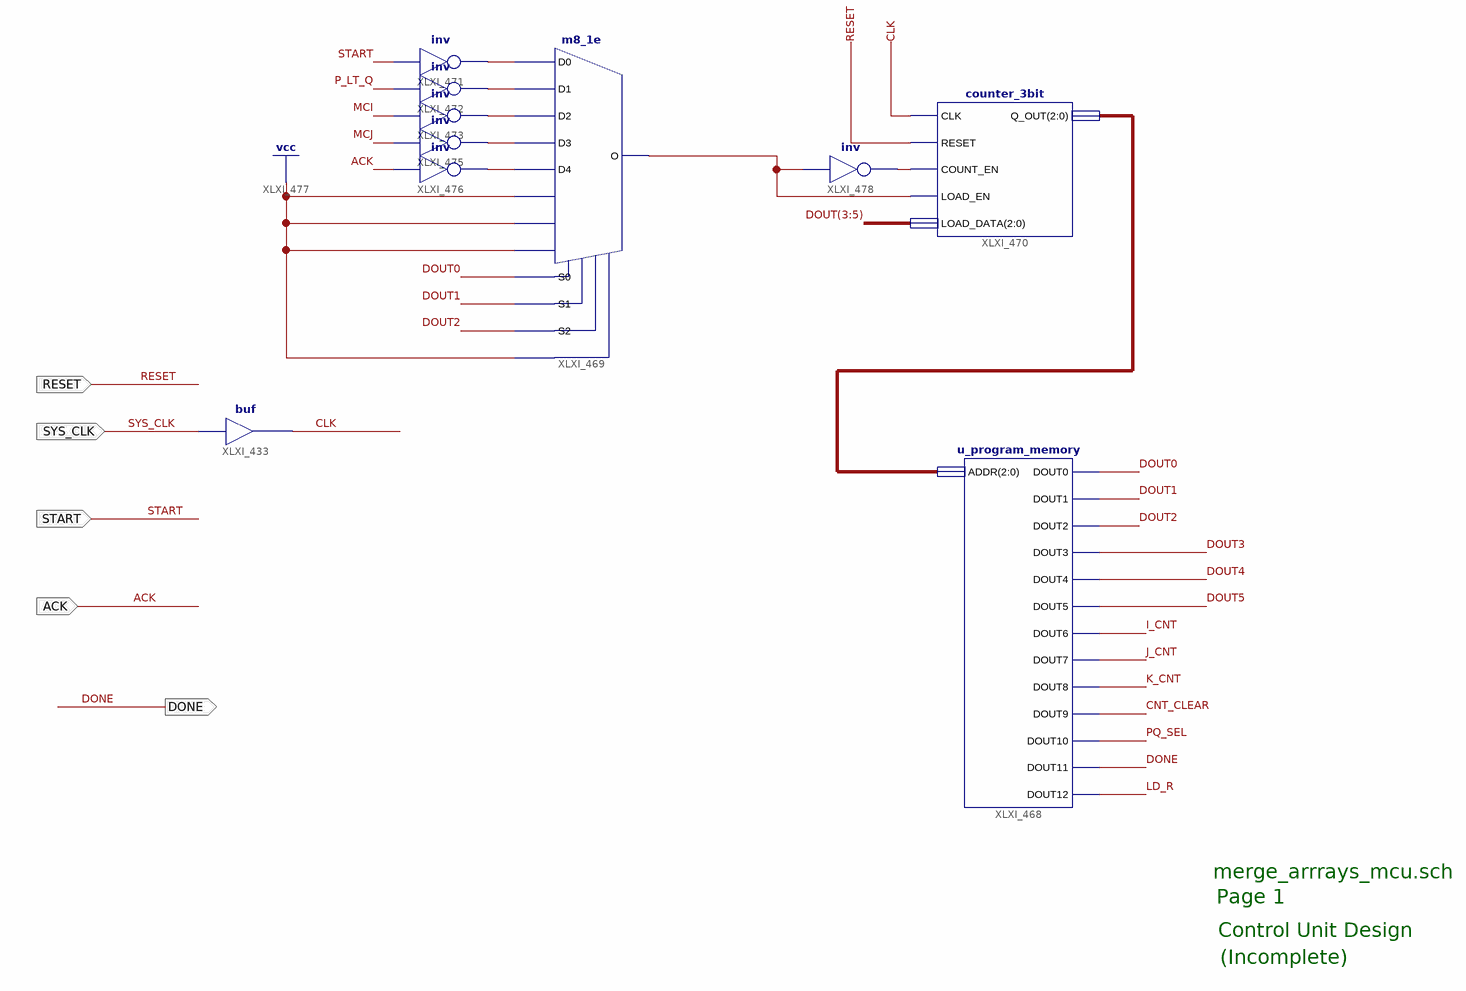
[diagram p0: schematic sheet 1]
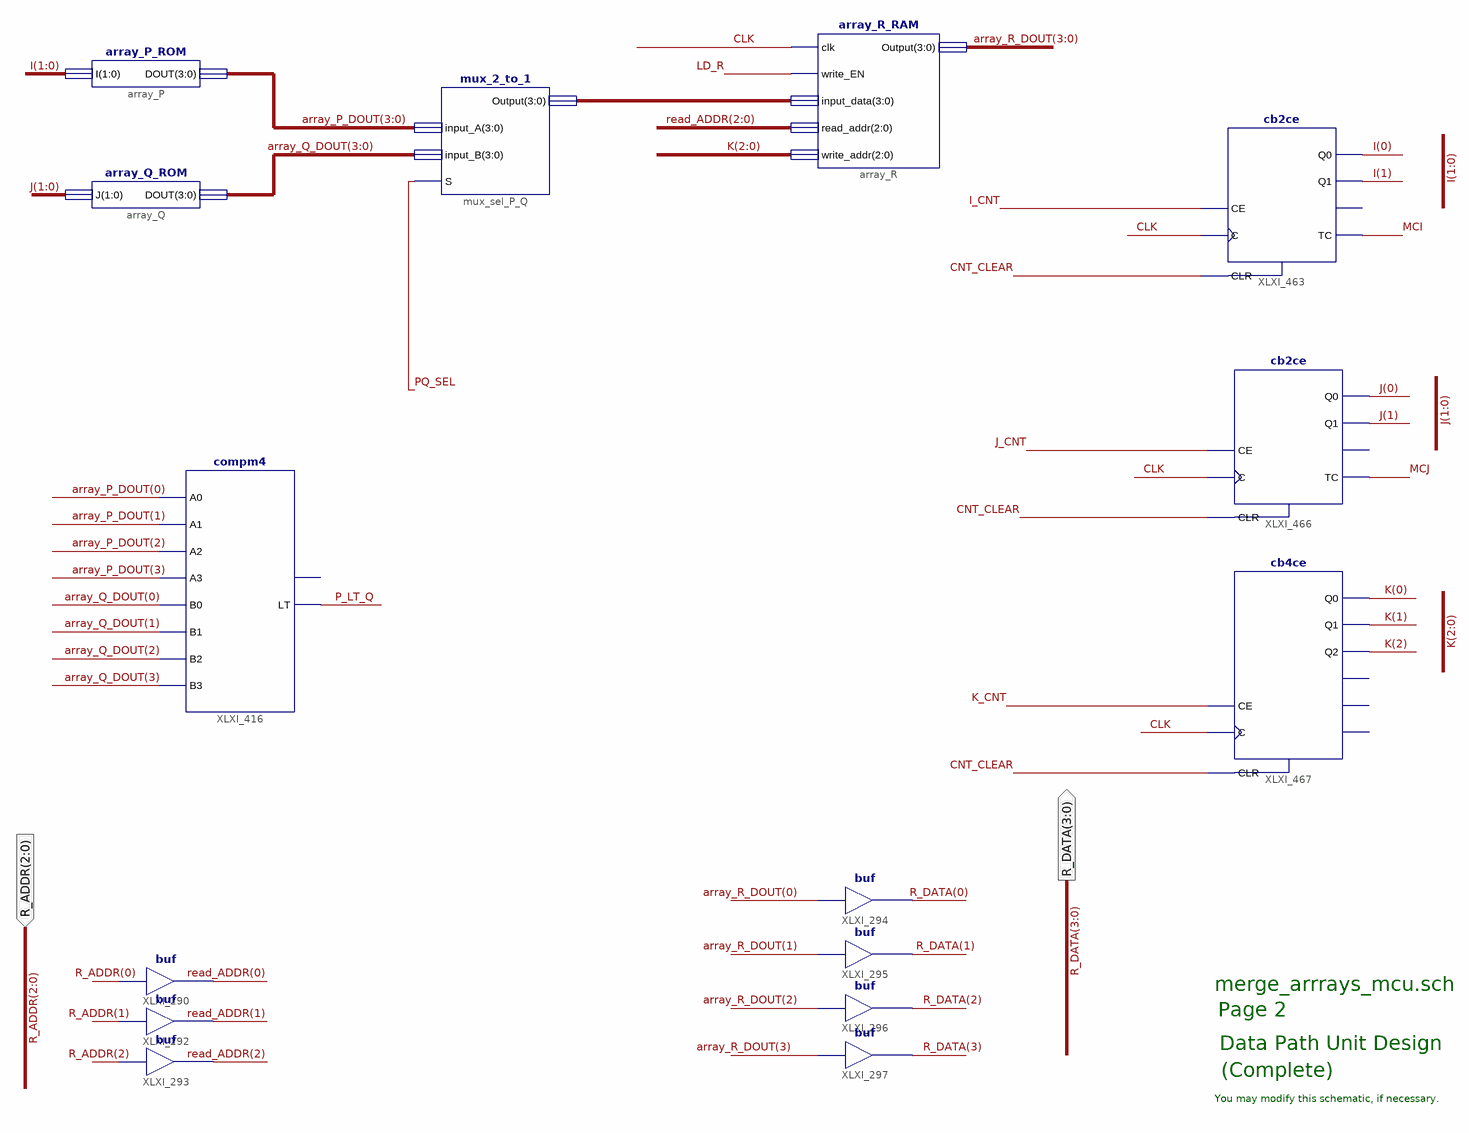
[diagram p1: schematic sheet 2]
// Xilinx ISE schematic merge_arrays_mcu.sch (spartan6) as structural Verilog: 25 symbols, 7 ports
module merge_arrays_mcu (
  input  ACK,
  input  RESET,
  input  SYS_CLK,
  input  START,
  input  [2:0] R_ADDR,
  output [3:0] R_DATA,
  output DONE
);

  wire CLK, CNT_CLEAR, DOUT0, DOUT1, DOUT2, DOUT3, DOUT4, DOUT5, I_CNT, J_CNT, K_CNT, LD_R, MCI, MCJ, P_LT_Q,
       PQ_SEL, XLXN_805, XLXN_806, XLXN_807, XLXN_808, XLXN_809, XLXN_832, XLXN_833;
  wire [1:0] I, J;
  wire [2:0] K, read_ADDR, XLXN_836;
  wire [3:0] array_P_DOUT, array_Q_DOUT, array_R_DOUT, XLXN_149;
  wire [5:3] DOUT;

  array_P_ROM array_P (.I(I), .DOUT(array_P_DOUT));
  array_Q_ROM array_Q (.J(J), .DOUT(array_Q_DOUT));
  mux_2_to_1 mux_sel_P_Q (.input_A(array_P_DOUT), .input_B(array_Q_DOUT), .Output(XLXN_149), .S(PQ_SEL));
  array_R_RAM array_R (
    .clk(CLK), .write_EN(LD_R), .input_data(XLXN_149), .read_addr(read_ADDR), .write_addr(K),
    .Output(array_R_DOUT));
  buf XLXI_294 (R_DATA[0], array_R_DOUT[0]);
  buf XLXI_295 (R_DATA[1], array_R_DOUT[1]);
  buf XLXI_296 (R_DATA[2], array_R_DOUT[2]);
  buf XLXI_297 (R_DATA[3], array_R_DOUT[3]);
  compm4 XLXI_416 (
    .A0(array_P_DOUT[0]), .A1(array_P_DOUT[1]), .A2(array_P_DOUT[2]), .A3(array_P_DOUT[3]),
    .B0(array_Q_DOUT[0]), .B1(array_Q_DOUT[1]), .B2(array_Q_DOUT[2]), .B3(array_Q_DOUT[3]), .LT(P_LT_Q));  // open: GT
  buf XLXI_290 (read_ADDR[0], R_ADDR[0]);
  buf XLXI_292 (read_ADDR[1], R_ADDR[1]);
  buf XLXI_293 (read_ADDR[2], R_ADDR[2]);
  buf XLXI_433 (CLK, SYS_CLK);
  cb2ce XLXI_463 (.C(CLK), .CE(I_CNT), .CLR(CNT_CLEAR), .Q0(I[0]), .Q1(I[1]), .TC(MCI));  // open: CEO
  cb2ce XLXI_466 (.C(CLK), .CE(J_CNT), .CLR(CNT_CLEAR), .Q0(J[0]), .Q1(J[1]), .TC(MCJ));  // open: CEO
  cb4ce XLXI_467 (.C(CLK), .CE(K_CNT), .CLR(CNT_CLEAR), .Q0(K[0]), .Q1(K[1]), .Q2(K[2]));  // open: CEO, Q3, TC
  u_program_memory XLXI_468 (
    .ADDR(XLXN_836), .DOUT0(DOUT0), .DOUT1(DOUT1), .DOUT2(DOUT2), .DOUT3(DOUT3), .DOUT4(DOUT4),
    .DOUT5(DOUT5), .DOUT6(I_CNT), .DOUT7(J_CNT), .DOUT8(K_CNT), .DOUT9(CNT_CLEAR), .DOUT10(PQ_SEL),
    .DOUT11(DONE), .DOUT12(LD_R));
  m8_1e XLXI_469 (
    .D0(XLXN_805), .D1(XLXN_806), .D2(XLXN_807), .D3(XLXN_808), .D4(XLXN_809), .D5(1'b1), .D6(1'b1),
    .D7(1'b1), .E(1'b1), .S0(DOUT0), .S1(DOUT1), .S2(DOUT2), .O(XLXN_832));
  counter_3bit XLXI_470 (
    .CLK(CLK), .RESET(RESET), .COUNT_EN(XLXN_833), .LOAD_EN(XLXN_832),
    .LOAD_DATA({DOUT[3], DOUT[4], DOUT[5]}), .Q_OUT(XLXN_836));
  not XLXI_471 (XLXN_805, START);
  not XLXI_472 (XLXN_806, P_LT_Q);
  not XLXI_473 (XLXN_807, MCI);
  not XLXI_475 (XLXN_808, MCJ);
  not XLXI_476 (XLXN_809, ACK);
  not XLXI_478 (XLXN_833, XLXN_832);

  // Notes on the sheet:
  //   merge_arrrays_mcu.sch
  //   Page 1
  //   Control Unit Design
  //   (Incomplete)
  //   merge_arrrays_mcu.sch
  //   Page 2
  //   Data Path Unit Design
  //   (Complete)
  //   You may modify this schematic, if necessary.
endmodule
